# Altium schematic sheet Micro.SchDoc
size A
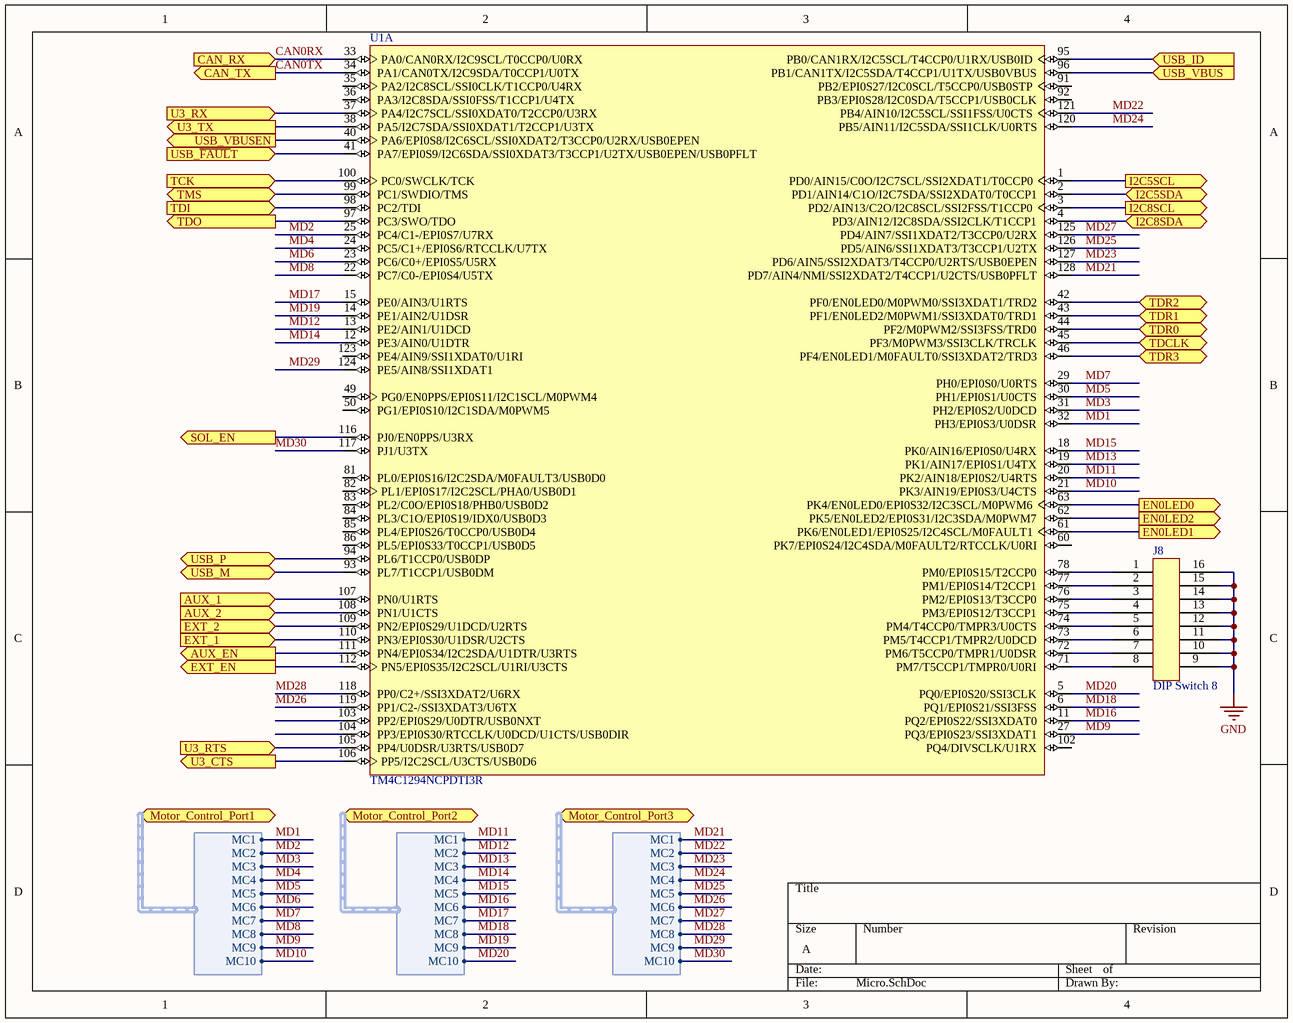
[diagram p0: Micro.SchDoc]

## Parts
J8  DIP Switch 8  [DIP8]
U1  TM4C1294NCPDTI3R  [TI-PDT128_M]  (part A of 3)

## Ports
AUX_1 (in), AUX_2 (in), AUX_EN (out), CAN_RX (in), CAN_TX (out), EN0LED0 (out), EN0LED1 (out), EN0LED2 (out), EXT_1 (in), EXT_2 (in), EXT_EN (out), I2C5SCL (out), I2C5SDA (bidir), I2C8SCL (out), I2C8SDA (bidir), Motor_Control_Port1 (harness MCP), Motor_Control_Port2 (harness MCP), Motor_Control_Port3 (harness MCP), SOL_EN (out), TCK (in), TDCLK (bidir), TDI (in), TDO (out), TDR0 (bidir), TDR1 (bidir), TDR2 (bidir), TDR3 (bidir), TMS (bidir), U3_CTS (out), U3_RTS (in), U3_RX (in), U3_TX (out), USB_ID (in), USB_M (bidir), USB_P (bidir), USB_VBUS (in), USB_VBUSEN (out), USB_~{FAUL}T (in)

## Harnesses
MCP: MC1, MC2, MC3, MC4, MC5, MC6, MC7, MC8, MC9, MC10

## Nets
GND: J8.9 J8.10 J8.11 J8.12 J8.13 J8.14 J8.15 J8.16
AUX_1: U1.107(PN0/U1RTS) ; port AUX_1
AUX_2: U1.108(PN1/U1CTS) ; port AUX_2
AUX_EN: U1.111(PN4/EPI0S34/I2C2SDA/U1DTR/U3RTS) ; port AUX_EN
CAN0RX: U1.33(PA0/CAN0RX/I2C9SCL/T0CCP0/U0RX) ; port CAN_RX
CAN0TX: U1.34(PA1/CAN0TX/I2C9SDA/T0CCP1/U0TX) ; port CAN_TX
EN0LED0: U1.63(PK4/EN0LED0/EPI0S32/I2C3SCL/M0PWM6) ; port EN0LED0
EN0LED1: U1.61(PK6/EN0LED1/EPI0S25/I2C4SCL/M0FAULT1) ; port EN0LED1
EN0LED2: U1.62(PK5/EN0LED2/EPI0S31/I2C3SDA/M0PWM7) ; port EN0LED2
EXT_1: U1.110(PN3/EPI0S30/U1DSR/U2CTS) ; port EXT_1
EXT_2: U1.109(PN2/EPI0S29/U1DCD/U2RTS) ; port EXT_2
EXT_EN: U1.112(PN5/EPI0S35/I2C2SCL/U1RI/U3CTS) ; port EXT_EN
I2C5SCL: U1.1(PD0/AIN15/C0O/I2C7SCL/SSI2XDAT1/T0CCP0) ; port I2C5SCL
I2C5SDA: U1.2(PD1/AIN14/C1O/I2C7SDA/SSI2XDAT0/T0CCP1) ; port I2C5SDA
I2C8SCL: U1.3(PD2/AIN13/C2O/I2C8SCL/SSI2FSS/T1CCP0) ; port I2C8SCL
I2C8SDA: U1.4(PD3/AIN12/I2C8SDA/SSI2CLK/T1CCP1) ; port I2C8SDA
MD1: U1.32(PH3/EPI0S3/U0DSR) ; port Motor_Control_Port1.MC1
MD2: U1.25(PC4/C1-/EPI0S7/U7RX) ; port Motor_Control_Port1.MC2
MD3: U1.31(PH2/EPI0S2/U0DCD) ; port Motor_Control_Port1.MC3
MD4: U1.24(PC5/C1+/EPI0S6/RTCCLK/U7TX) ; port Motor_Control_Port1.MC4
MD5: U1.30(PH1/EPI0S1/U0CTS) ; port Motor_Control_Port1.MC5
MD6: U1.23(PC6/C0+/EPI0S5/U5RX) ; port Motor_Control_Port1.MC6
MD7: U1.29(PH0/EPI0S0/U0RTS) ; port Motor_Control_Port1.MC7
MD8: U1.22(PC7/C0-/EPI0S4/U5TX) ; port Motor_Control_Port1.MC8
MD9: U1.27(PQ3/EPI0S23/SSI3XDAT1) ; port Motor_Control_Port1.MC9
MD10: U1.21(PK3/AIN19/EPI0S3/U4CTS) ; port Motor_Control_Port1.MC10
MD11: U1.20(PK2/AIN18/EPI0S2/U4RTS) ; port Motor_Control_Port2.MC1
MD12: U1.13(PE2/AIN1/U1DCD) ; port Motor_Control_Port2.MC2
MD13: U1.19(PK1/AIN17/EPI0S1/U4TX) ; port Motor_Control_Port2.MC3
MD14: U1.12(PE3/AIN0/U1DTR) ; port Motor_Control_Port2.MC4
MD15: U1.18(PK0/AIN16/EPI0S0/U4RX) ; port Motor_Control_Port2.MC5
MD16: U1.11(PQ2/EPI0S22/SSI3XDAT0) ; port Motor_Control_Port2.MC6
MD17: U1.15(PE0/AIN3/U1RTS) ; port Motor_Control_Port2.MC7
MD18: U1.6(PQ1/EPI0S21/SSI3FSS) ; port Motor_Control_Port2.MC8
MD19: U1.14(PE1/AIN2/U1DSR) ; port Motor_Control_Port2.MC9
MD20: U1.5(PQ0/EPI0S20/SSI3CLK) ; port Motor_Control_Port2.MC10
MD21: U1.128(PD7/AIN4/NMI/SSI2XDAT2/T4CCP1/U2CTS/USB0PFLT) ; port Motor_Control_Port3.MC1
MD22: U1.121(PB4/AIN10/I2C5SCL/SSI1FSS/U0CTS) ; port Motor_Control_Port3.MC2
MD23: U1.127(PD6/AIN5/SSI2XDAT3/T4CCP0/U2RTS/USB0EPEN) ; port Motor_Control_Port3.MC3
MD24: U1.120(PB5/AIN11/I2C5SDA/SSI1CLK/U0RTS) ; port Motor_Control_Port3.MC4
MD25: U1.126(PD5/AIN6/SSI1XDAT3/T3CCP1/U2TX) ; port Motor_Control_Port3.MC5
MD26: U1.119(PP1/C2-/SSI3XDAT3/U6TX) ; port Motor_Control_Port3.MC6
MD27: U1.125(PD4/AIN7/SSI1XDAT2/T3CCP0/U2RX) ; port Motor_Control_Port3.MC7
MD28: U1.118(PP0/C2+/SSI3XDAT2/U6RX) ; port Motor_Control_Port3.MC8
MD29: U1.124(PE5/AIN8/SSI1XDAT1) ; port Motor_Control_Port3.MC9
MD30: U1.117(PJ1/U3TX) ; port Motor_Control_Port3.MC10
SOL_EN: U1.116(PJ0/EN0PPS/U3RX) ; port SOL_EN
TCK: U1.100(PC0/SWCLK/TCK) ; port TCK
TDCLK: U1.45(PF3/M0PWM3/SSI3CLK/TRCLK) ; port TDCLK
TDI: U1.98(PC2/TDI) ; port TDI
TDO: U1.97(PC3/SWO/TDO) ; port TDO
TDR0: U1.44(PF2/M0PWM2/SSI3FSS/TRD0) ; port TDR0
TDR1: U1.43(PF1/EN0LED2/M0PWM1/SSI3XDAT0/TRD1) ; port TDR1
TDR2: U1.42(PF0/EN0LED0/M0PWM0/SSI3XDAT1/TRD2) ; port TDR2
TDR3: U1.46(PF4/EN0LED1/M0FAULT0/SSI3XDAT2/TRD3) ; port TDR3
TMS: U1.99(PC1/SWDIO/TMS) ; port TMS
U3_CTS: U1.106(PP5/I2C2SCL/U3CTS/USB0D6) ; port U3_CTS
U3_RTS: U1.105(PP4/U0DSR/U3RTS/USB0D7) ; port U3_RTS
U3_RX: U1.37(PA4/I2C7SCL/SSI0XDAT0/T2CCP0/U3RX) ; port U3_RX
U3_TX: U1.38(PA5/I2C7SDA/SSI0XDAT1/T2CCP1/U3TX) ; port U3_TX
USB_~{FAUL}T: U1.41(PA7/EPI0S9/I2C6SDA/SSI0XDAT3/T3CCP1/U2TX/USB0EPEN/USB0PFLT) ; port USB_~{FAUL}T
USB_ID: U1.95(PB0/CAN1RX/I2C5SCL/T4CCP0/U1RX/USB0ID) ; port USB_ID
USB_M: U1.93(PL7/T1CCP1/USB0DM) ; port USB_M
USB_P: U1.94(PL6/T1CCP0/USB0DP) ; port USB_P
USB_VBUS: U1.96(PB1/CAN1TX/I2C5SDA/T4CCP1/U1TX/USB0VBUS) ; port USB_VBUS
USB_VBUSEN: U1.40(PA6/EPI0S8/I2C6SCL/SSI0XDAT2/T3CCP0/U2RX/USB0EPEN) ; port USB_VBUSEN
NetJ8_1: J8.1 U1.78(PM0/EPI0S15/T2CCP0)
NetJ8_2: J8.2 U1.77(PM1/EPI0S14/T2CCP1)
NetJ8_3: J8.3 U1.76(PM2/EPI0S13/T3CCP0)
NetJ8_4: J8.4 U1.75(PM3/EPI0S12/T3CCP1)
NetJ8_5: J8.5 U1.74(PM4/T4CCP0/TMPR3/U0CTS)
NetJ8_6: J8.6 U1.73(PM5/T4CCP1/TMPR2/U0DCD)
NetJ8_7: J8.7 U1.72(PM6/T5CCP0/TMPR1/U0DSR)
NetJ8_8: J8.8 U1.71(PM7/T5CCP1/TMPR0/U0RI)

Not connected (* = marked no-connect by the designer): U1 35(PA2/I2C8SCL/SSI0CLK/T1CCP0/U4RX) 36(PA3/I2C8SDA/SSI0FSS/T1CCP1/U4TX) 49(PG0/EN0PPS/EPI0S11/I2C1SCL/M0PWM4) 50(PG1/EPI0S10/I2C1SDA/M0PWM5) 60(PK7/EPI0S24/I2C4SDA/M0FAULT2/RTCCLK/U0RI) 81(PL0/EPI0S16/I2C2SDA/M0FAULT3/USB0D0) 82(PL1/EPI0S17/I2C2SCL/PHA0/USB0D1) 83(PL2/C0O/EPI0S18/PHB0/USB0D2) 84(PL3/C1O/EPI0S19/IDX0/USB0D3) 85(PL4/EPI0S26/T0CCP0/USB0D4) 86(PL5/EPI0S33/T0CCP1/USB0D5) 91(PB2/EPI0S27/I2C0SCL/T5CCP0/USB0STP) 92(PB3/EPI0S28/I2C0SDA/T5CCP1/USB0CLK) 102(PQ4/DIVSCLK/U1RX) 103(PP2/EPI0S29/U0DTR/USB0NXT) 104(PP3/EPI0S30/RTCCLK/U0DCD/U1CTS/USB0DIR) 123(PE4/AIN9/SSI1XDAT0/U1RI)

## Library data of the parts
J8 = DIP8: Supplier 1: Digikey; Supplier Part Number 1: CT3111-ND
U1 = CMP-0945-00007-1: Tiva C Series Microcontroller, 1024 KB Flash, 256 KB SRAM, 12 Bit, 20 Channels, -40 to 85 degC, 128-Pin TQFP (PDT), Green (RoHS & no Sb/Br), Tape and Reel; Manufacturer: Texas Instruments; SRAM: 256 KB; ADC Resolution: 12 Bits; ADC Channels: 20; Flash: 1024 KB; Max Speed: 120 MHz; CPU: ARM Cortex-M4; Packing: Tape and Reel; Mounting Technology: Surface Mount; Eco-Plan: Green (RoHS & no Sb/Br); ComponentLink1URL: http://www.ti.com/; ComponentLink3Description: Package Specification; ComponentLink2Description: Datasheet; PartNumber: TM4C1294NCPDTI3R; DatasheetVersion: 15863.2743; ComponentLink1Description: Manufacturer URL; ComponentLink3URL: http://www.ti.com/lit/ml/mpqf013/mpqf013.pdf; Temperature Range: -40 to 85 degC; ComponentLink2URL: http://www.ti.com/lit/ds/symlink/tm4c1294ncpdt.pdf; PackageVersion: 4087726/A; PackageDescription: 128-Pin Thin Quad Flat Package, Body 14 x 14 mm, Pitch 0.4 mm